# Altium project İHA-PDU.PrjPcb (part 9 of 13)
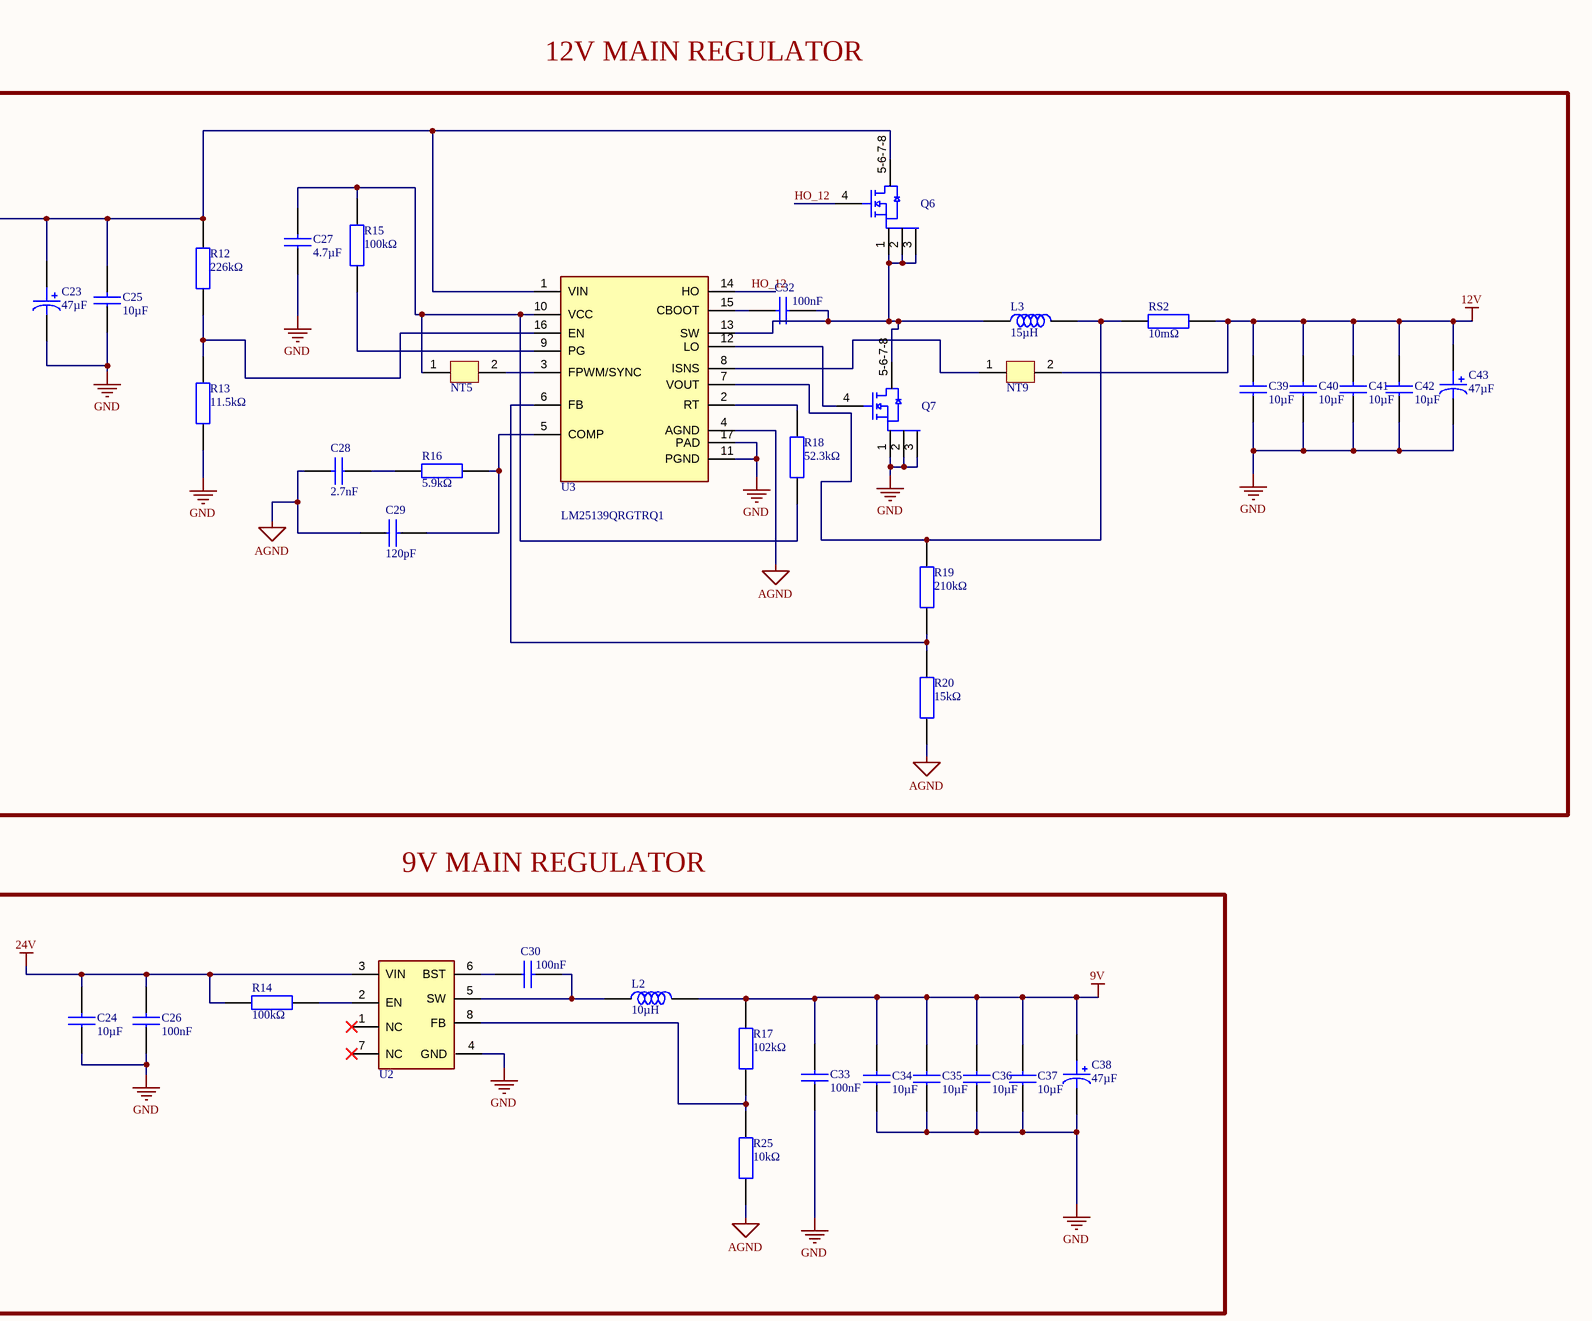
[diagram p15: 12V_9V_Power_Stage.SchDoc, right]

## Sheet 12V_9V_Power_Stage.SchDoc (continued)

### Library data of the parts (continued)
U2 = TPS563300DRLR: 3.8-V to 28-V Input, 3-A synchronous buck converter in SOT-583 package 8-SOT-5X3 -40 to 150; Manufacturer: Texas Instruments; Manufacturer Lifecycle Status: ACTIVE; Supplier: Mouser; Supplier Part Number: 595-TPS563300DRLR; Manufacturer Part Number: TPS563300DRLR; RoHS: Compliant; Category: Voltage Regulators - Switching; Stock: 32724; Pricing: 1=1,32, 10=0,956, 50=0,864, 100=0,762, 1000=0,605, 10000=0,531 (USD); Height: 0m; Length: 2.1mm; Lifecycle Status: Production; Pins: 8; Thickness: 550µm; Topology: Buck; Width: 1.2mm; ComponentLink1URL: https://sigma.octopart.com:443/184160452/technical_drawing/Texas-Instruments-TPS563300DRLR.pdf?src-supplier=Texas+Instruments; ComponentLink1Description: https://sigma.octopart.com:443/184160452/technical_drawing/Texas-Instruments-TPS563300DRLR.pdf?src-supplier=Texas+Instruments; ComponentLink2URL: https://octopart.com:443/opatz8j6/c1?t=xatpEYDGIma3GWOGr9dSa4ETkpKnF2SQQa13bM9aBU7KxWKWjVvMG3OPAuux2PU110RkBH42izBS6LQikCKLapn2aXxzoaBnKyQv6nxenhgHckViipDy1bQp576I8K_6VNlc5vIfTlftyYntTgTTchaaEZUGX-QlB6H4FcZbf9QiACksJe2cvrVzl7ha9aT0dFxNxtO1rifgiUUvS9aKQPq8xHoc_jRZa0IMvCz_1WpyurF6xnm4nw4x1HnPVrE7nKBo3o6VYz8s45vJQula6-TlgbN471KnlcUrcyjw7J9yvMadwJHAulvEz1WOv1H4BbQVsLOSbcIeQMVCaHMcaU52k2MGaSgAor6JMwICFe1qviFLaeeRGWmBODRvWzrX-l5DBmed0Tw&src-supplier=Texas+Instruments; ComponentLink2Description: https://octopart.com:443/opatz8j6/c1?t=xatpEYDGIma3GWOGr9dSa4ETkpKnF2SQQa13bM9aBU7KxWKWjVvMG3OPAuux2PU110RkBH42izBS6LQikCKLapn2aXxzoaBnKyQv6nxenhgHckViipDy1bQp576I8K_6VNlc5vIfTlftyYntTgTTchaaEZUGX-QlB6H4FcZbf9QiACksJe2cvrVzl7ha9aT0dFxNxtO1rifgiUUvS9aKQPq8xHoc_jRZa0IMvCz_1WpyurF6xnm4nw4x1HnPVrE7nKBo3o6VYz8s45vJQula6-TlgbN471KnlcUrcyjw7J9yvMadwJHAulvEz1WOv1H4BbQVsLOSbcIeQMVCaHMcaU52k2MGaSgAor6JMwICFe1qviFLaeeRGWmBODRvWzrX-l5DBmed0Tw&src-supplier=Texas+Instruments; ComponentLink3URL: https://sigma.octopart.com:443/182665545/technical_drawing/Texas-Instruments-TPS563300DRLR.pdf?src-supplier=Texas+Instruments; ComponentLink3Description: https://sigma.octopart.com:443/182665545/technical_drawing/Texas-Instruments-TPS563300DRLR.pdf?src-supplier=Texas+Instruments; ComponentLink4URL: https://sigma.octopart.com:443/158891806/technical_drawing/Texas-Instruments-TPS563300DRLR.pdf?src-supplier=Texas+Instruments; ComponentLink4Description: https://sigma.octopart.com:443/158891806/technical_drawing/Texas-Instruments-TPS563300DRLR.pdf?src-supplier=Texas+Instruments; ComponentLink5URL: https://datasheet.octopart.com:443/TPS563300DRLR-Texas-Instruments-datasheet-179559971.pdf?src-supplier=LCSC; ComponentLink5Description: https://datasheet.octopart.com:443/TPS563300DRLR-Texas-Instruments-datasheet-179559971.pdf?src-supplier=LCSC; ComponentLink6URL: http://sigma.octopart.com:80/reach_statement/Texas-Instruments-company-64.pdf?src-supplier=Compliance+Statements; ComponentLink6Description: http://sigma.octopart.com:80/reach_statement/Texas-Instruments-company-64.pdf?src-supplier=Compliance+Statements; ComponentLink7URL: http://sigma.octopart.com:80/conflict_mineral_statement/Texas-Instruments-company-63.pdf?src-supplier=Compliance+Statements; ComponentLink7Description: http://sigma.octopart.com:80/conflict_mineral_statement/Texas-Instruments-company-63.pdf?src-supplier=Compliance+Statements
U3 = LM25139QRGTRQ1: Automotive 42V input low-Iq buck controller with advanced spread spectrum for low EMI 16-VQFN -40 to 150; Manufacturer: Texas Instruments; Manufacturer Lifecycle Status: ACTIVE; Supplier: Arrow Electronics; Supplier Part Number: LM25139QRGTRQ1; Manufacturer Part Number: LM25139QRGTRQ1; RoHS: Compliant; Category: Integrated Circuits (ICs); Pricing: 3000=1,4038, 6000=1,3973, 9000=1,3906, 12000=1,384, 15000=1,3772, 21000=1,3704, 24000=1,3635, 30000=1,3565, 75000=1,3494 (USD); Case/Package: VQFN; Height: 1mm; Length: 3mm; Lifecycle Status: Production; Pins: 16; Thickness: 900µm; Width: 3mm; ComponentLink1URL: https://octopart.com:443/opatz8j6/c1?t=xWWGwO3ec4Sx5CX0X2qnIhfOHeHqh3WO1mWCu4fV70Hd-1hWOrNd3lhOLVAWMYEEdzkDMYq8UgUcPu2a5nJWOdgA0b1awjV5RgR9D21gaMlGiLRjb7yDuVOicm1d_02R7igS8Xl7-riSRfD_iig_z43OjN5LLsjZDt-zpIDOeZS1dmRgmlIMnUHEnLRcU50Rs-JpA3b7vouLRhIT49FH8fzbO6qOR_6mRAVC4kh14i2ZohtaykkOFzOvEuXGiEP1bYPJMrSXFUnpstjeZJ5v1PNY2ZRTlMohWo1i0R4TEEEijwc0FwBrv5FRwCkRRvUZM3VTnVJr8q7ERahnvQ1r2dQr48eXvtum-5d3g9rmVpLBhcUjM08_c0KTsN9BfI_8WmgwxHDs6sfT&src-supplier=Texas+Instruments; ComponentLink1Description: https://octopart.com:443/opatz8j6/c1?t=xWWGwO3ec4Sx5CX0X2qnIhfOHeHqh3WO1mWCu4fV70Hd-1hWOrNd3lhOLVAWMYEEdzkDMYq8UgUcPu2a5nJWOdgA0b1awjV5RgR9D21gaMlGiLRjb7yDuVOicm1d_02R7igS8Xl7-riSRfD_iig_z43OjN5LLsjZDt-zpIDOeZS1dmRgmlIMnUHEnLRcU50Rs-JpA3b7vouLRhIT49FH8fzbO6qOR_6mRAVC4kh14i2ZohtaykkOFzOvEuXGiEP1bYPJMrSXFUnpstjeZJ5v1PNY2ZRTlMohWo1i0R4TEEEijwc0FwBrv5FRwCkRRvUZM3VTnVJr8q7ERahnvQ1r2dQr48eXvtum-5d3g9rmVpLBhcUjM08_c0KTsN9BfI_8WmgwxHDs6sfT&src-supplier=Texas+Instruments; ComponentLink2URL: http://sigma.octopart.com:80/reach_statement/Texas-Instruments-company-64.pdf?src-supplier=Compliance+Statements; ComponentLink2Description: http://sigma.octopart.com:80/reach_statement/Texas-Instruments-company-64.pdf?src-supplier=Compliance+Statements; ComponentLink3URL: http://sigma.octopart.com:80/conflict_mineral_statement/Texas-Instruments-company-63.pdf?src-supplier=Compliance+Statements; ComponentLink3Description: http://sigma.octopart.com:80/conflict_mineral_statement/Texas-Instruments-company-63.pdf?src-supplier=Compliance+Statements

## Sheet 5V_Power_Stage.SchDoc
size 431 x 279 mm; Organization: ORGANIZATION; Address1: ADDRESS 1; Address2: ADDRESS 2; Address3: ADDRESS 3; Address4: ADDRESS 4; Revision: -; SheetNumber: 5; SheetTotal: 6; ENG_APP_DATE: --/--/--; DSN_APP_DATE: --/--/--; CHK_APP_DATE: --/--/--
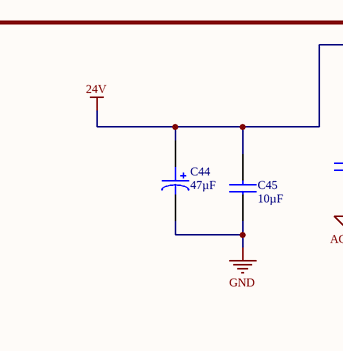
[diagram p5: 5V_Power_Stage.SchDoc, left]
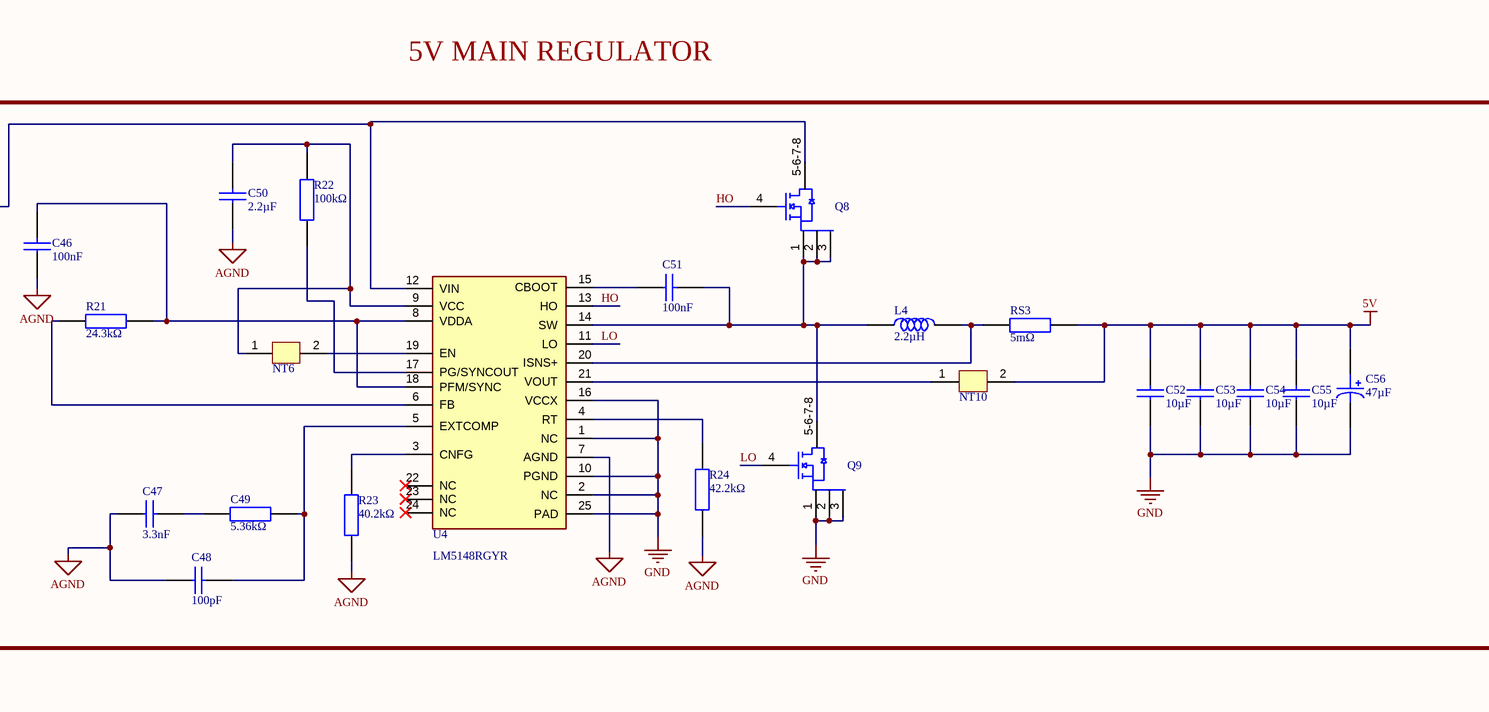
[diagram p6: 5V_Power_Stage.SchDoc, right]

### Parts
C44  value 47µF  [CAP ALUM SMD]  (hidden comment: EEHZA1H470P)
C45  value 10µF  [CAP_1206]  (hidden comment: C3216X7R1H106K160AC)
C46  value 100nF  [CAP_0402]  (hidden comment: GRM155R71A104KA01D)
C47  value 3.3nF  [CAP_0805]  (hidden comment: CGA4C2C0G1H332J060AA)
C48  value 100pF  [CAP_0805]  (hidden comment: CL21C101JBANNNC)
C49  value 5.36kΩ  [RES_0402]  (hidden comment: CRCW04025K36FKED)
C50  value 2.2µF  [CAP_0603]  (hidden comment: GRM188R71A225KE15D)
C51  value 100nF  [CAP_0402]  (hidden comment: GRM155R71A104KA01D)
C52  value 10µF  [CAP_1206]  (hidden comment: GRM31CR71E106KA12L)
C53  value 10µF  [CAP_1206]  (hidden comment: GRM31CR71E106KA12L)
C54  value 10µF  [CAP_1206]  (hidden comment: GRM31CR71E106KA12L)
C55  value 10µF  [CAP_1206]  (hidden comment: GRM31CR71E106KA12L)
C56  value 47µF  [CAP ALUM SMD]  (hidden comment: EEHZA1H470P)
L4  value 2.2µH  [XAL7070]  (hidden comment: XAL7070-222MEC)
NT6  Net-Tie  [Net-Tie]  (value not drawn)  (net tie, no BOM)
NT10  Net-Tie  [Net-Tie]  (value not drawn)  (net tie, no BOM)
Q8  CSD18540Q5B  [SON 5X6]  (value not drawn)
Q9  CSD18563Q5A  [SON 5X6]  (value not drawn)
R21  value 24.3kΩ  [RES_0402]  (hidden comment: CRCW040224K3FKED)
R22  value 100kΩ  [RES_0603]  (hidden comment: CRCW0603100KFKEA)
R23  value 40.2kΩ  [RES_0603]  (hidden comment: RC0603FR-0740K2L)
R24  value 42.2kΩ  [RES_0603]  (hidden comment: CRCW060342K2FKEA)
RS3  value 5mΩ  [RES_2010]  (hidden comment: CSNL2010FT5L00)
U4  LM5148RGYR  [VQFN-24]

### Nets
5V: C52.2 C53.2 C54.2 C55.2 C56.1(C) NT10.2 RS3.2
24V: C44.1(C) C45.2 Q8.5-6-7-8(D) U4.12(VIN)
AGND: C46.1 C47.1 C48.1 C50.1 R23.1 R24.1 U4.7(AGND)
GND: C44.2(A) C45.1 C52.1 C53.1 C54.1 C55.1 C56.2(A) Q9.1(S) Q9.2(S) Q9.3(S) U4.1(NC) U4.2(NC) U4.10(PGND) U4.16(VCCX) U4.25(PAD)
HO: Q8.4(G) U4.13(HO)
LO: Q9.4(G) U4.11(LO)
NetC46_2: C46.2 R21.2 U4.8(VDDA) U4.18(PFM/SYNC)
NetC47_2: C47.2 C49.1
NetC48_2: C48.2 C49.2 U4.5(EXTCOMP)
NetC50_2: C50.2 NT6.1 R22.2 U4.9(VCC)
NetC51_1: C51.1 U4.15(CBOOT)
NetC51_2: C51.2 L4.1 Q8.1(S) Q8.2(S) Q8.3(S) Q9.5-6-7-8(D) U4.14(SW)
NetL4_2: L4.2 RS3.1 U4.20(ISNS+)
NetNT6_2: NT6.2 U4.19(EN)
NetNT10_1: NT10.1 U4.21(VOUT)
NetR21_1: R21.1 U4.6(FB)
NetR22_1: R22.1 U4.17(PG/SYNCOUT)
NetR23_2: R23.2 U4.3(CNFG)
NetR24_2: R24.2 U4.4(RT)

Not connected (* = marked no-connect by the designer): U4 22(NC)* 23(NC)* 24(NC)*

### Notes on the sheet
- 5V MAIN REGULATOR
- DWG. NO.
- REV.
- SHT.
- THIS DOCUMENT AND THE DATA DISCLOSED HEREIN OR HEREWITH IS THE PROPERTY OF ALTIUM LIMITED AND MAY BE FREELY DISTRIBUTED IN WHOLE. NO RIGHTS ARE RESERVED OR EXPRESS OR IMPLIED WARANTEE GIVEN.
- REVISION
- DESCRIPTION
- DATE
- APPROVED
- ENG:
- DSN:
- APPROVALS
- PROJECT REVISION:
- www.altium.com <http://www.altium.com>
- DOCUMENT REVISION:
- 92037, La Jolla
- USA
- Altium Ltd.
- 4225 Executive Square
- CHK:
- REFERENCE DOCUMENTS
- DESIGN ITEM:
- TITLE
- VARIANT
- BOM:
- FAB DWG:
- PCB DWG:
- ASSY DWG:
- SCALE:
- SIZE
- B
- CAGE CODE
- FILE NAME
- DWG NO.
- SHEET
- OF
- REV